# Altium schematic sheet MCP2515.SchDoc
size A4
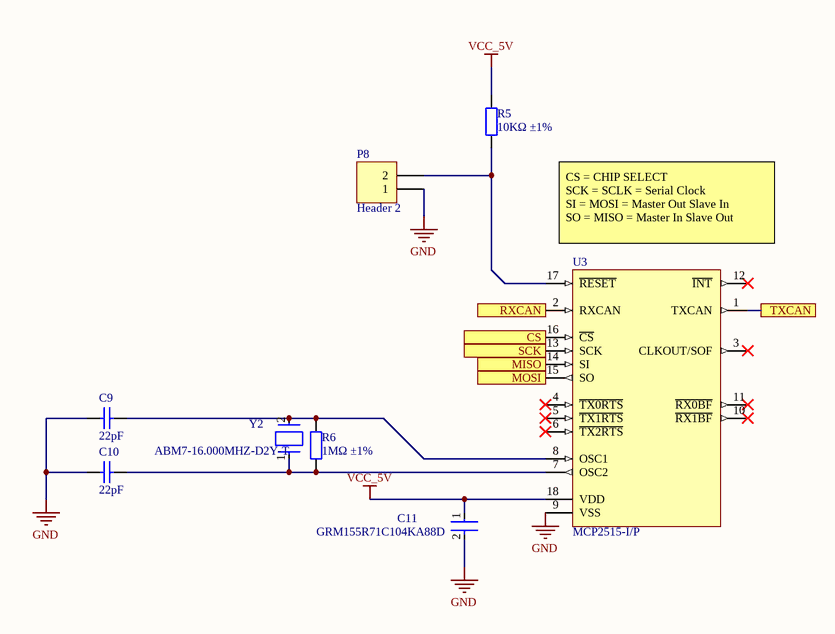
[diagram p0: MCP2515.SchDoc]

## Parts
C9  22pF  [0603_C]
C10  22pF  [0603_C]
C11  GRM155R71C104KA88D  [FP-GRM15-MFG]
P8  Header 2  [HDR1X2]
R5  10KΩ ±1%  [0603_R]
R6  1MΩ ±1%  [0603_R]
U3  MCP2515-I/P  [PDIP300-P18]
Y2  ABM7-16.000MHZ-D2Y-T  [FP-ABM7-MFG]

## Ports
CS, MISO, MOSI, RXCAN, SCK, TXCAN

## Nets
GND: C9.1 C10.1 C11.2 P8.1 U3.9(VSS)
VCC_5V: C11.1 R5.2 U3.18(VDD)
CS: U3.16(~{CS}) ; port CS
MISO: U3.14(SI) ; port MISO
MOSI: U3.15(SO) ; port MOSI
RXCAN: U3.2(RXCAN) ; port RXCAN
SCK: U3.13(SCK) ; port SCK
TXCAN: U3.1(TXCAN) ; port TXCAN
NetC9_2: C9.2 R6.2 U3.8(OSC1) Y2.2
NetC10_2: C10.2 R6.1 U3.7(OSC2) Y2.1
NetP8_2: P8.2 R5.1 U3.17(~{RESET})

Not connected (* = marked no-connect by the designer): U3 3(CLKOUT/SOF)* 4(~{TX0RTS})* 5(~{TX1RTS})* 6(~{TX2RTS})* 10(~{RX1BF})* 11(~{RX0BF})* 12(~{INT})*

## Notes on the sheet
- (near U3) CS = CHIP SELECT
  SCK = SCLK = Serial Clock
  SI = MOSI = Master Out Slave In
  SO = MISO = Master In Slave Out

## Library data of the parts
C9 C10 = 0603 22pF (220) 5% 50V: Chip capacitors; Manufacturer: Samsung Electro-Mechanics; PartNumber: CL10C220JB8NNNC; Tolerance: 5%; Voltage: 50V; ComponentLink1Description: Supplier link; ComponentLink1URL: http://www.szlcsc.com/product/details_2005.html; Package: 0603; Supplier: LC; SuppliersPartNumber: C1653; Capacitance: 22pF
C11 = CMP-2100-03641-2: CAP CER 0.1UF 16V X7R 0402; Manufacturer: Murata; Standoff Height: 0mm; Tolerance: 10%; Voltage Rating: 16Vdc; Material: Ceramic; Capacitance: 0.10μF; Value: 0.10μF; RoHS: TRUE; Manufacturer Part Number: GRM155R71C104KA88D; Temperature Characteristic: X7R; Octopart: https://octopart.com/grm155r71c104ka88d-murata-196880; Digikey Description: CAP CER 0.1UF 16V X7R 0402; Device Class L3: Ceramic Capacitors; Height: 0.55mm; ComponentLink2Description: Datasheet; Temperature Range Low: -55°C; Ipc Land Pattern Name: CAPC10050X219; ComponentLink2URL: https://search.murata.co.jp/Ceramy/image/img/A01X/G101/ENG/GRM155R71H471KA01-01A.pdf; Device Class L1: Passive Components; Lead Free: yes; Category: Cap; Package: GRM15; Temperature: -55°C to +125°C; Device Class L2: Capacitors; Temperature Range High: +125°C; Mouser Description: 0402 0.1 uF 16V ±10 % Tolerance X7R SMT Multilayer Ceramic Capacitor
P8 = Header 2: Header, 2-Pin; LatestRevisionDate: 17-Jul-2002; LatestRevisionNote: Re-released for DXP Platform.; Publisher: Altium Limited
R5 = 0603 10K (1002) 1%: Chip resistor; Manufacturer: Uniroyal Elec; PartNumber: 0603WAF1002T5E; Power: 1/10W; ComponentLink1Description: Supplier link; ComponentLink1URL: http://www.szlcsc.com/product/details_26547.html; Package: 0603; Supplier: LC; SuppliersPartNumber: C25804; Resistance: 10KΩ; Tolerance: 1%
R6 = 0603 1M (1004) 1%: Chip resistor; Manufacturer: Uniroyal Elec; PartNumber: 0603WAF1004T5E; Power: 1/10W; ComponentLink1Description: Supplier link; ComponentLink1URL: http://www.szlcsc.com/product/details_23662.html; Package: 0603; Supplier: LC; SuppliersPartNumber: C22935; Resistance: 1MΩ; Tolerance: 1%
U3 = CMP-0186-00010-2: Stand-Alone CAN Controller With SPI Interface, 18-Pin PDIP, Industrial Temperature; PackageReference: PDIP300-P18; ComponentLink3Description: Package Specification; PackageVersion: revBB, Aug-2009; ComponentLink2URL: http://ww1.microchip.com/downloads/en/DeviceDoc/21801f.pdf; RevisionNote: URLs added. DatasheetVersion updated.; Code_JEDEC: MS-001; PackageDescription: 18-Lead Plastic Dual In-Line (P) - 300 mil Body [PDIP]; ComponentLink1Description: Manufacturer URL; ComponentLink1URL: http://www.microchip.com/; DatasheetVersion: revF, Oct-2010; ComponentLink2Description: Datasheet; ComponentLink3URL: http://www.microchip.com/stellent/groups/techpub_sg/documents/packagingspec/en012702.pdf
Y2 = CMP-27762-000095-1: Crystal 16MHz ±20ppm 18pF SMD-2 6mm x 3.5mm; ESR (Equivalent Series Resistance): 50R; Frequency Stability: 30ppm; Width: 3.3mm; Frequency: 16MHz; Radiation Hardening: No; Height: 0.055inch; Tolerance: 20ppm; Length: 6mm; Case/Package: CSMD; Lead Free: Lead Free; Min Operating Temperature: -40°C; Termination: SMD/SMT; Operating Frequency: 16 MHz; Resistor Type: Ceramic; Packaging: Tape and Reel; Mount: Surface Mount; Load Capacitance: 18pF; Frequency Tolerance: 20ppm; Depth: 3.5mm; Series: ABM7; Package Quantity: 1000; Max Operating Temperature: 85°C; Number of Pins: 2